# EasyEDA schematic SCH_TSOP-32 Adapter_2022-05-23.json
TITLE: Sheet_1; REV: 1.0; Date: 2022-02-27; Sheet: 1/1; Drawn By: hans61; Company: Your Company
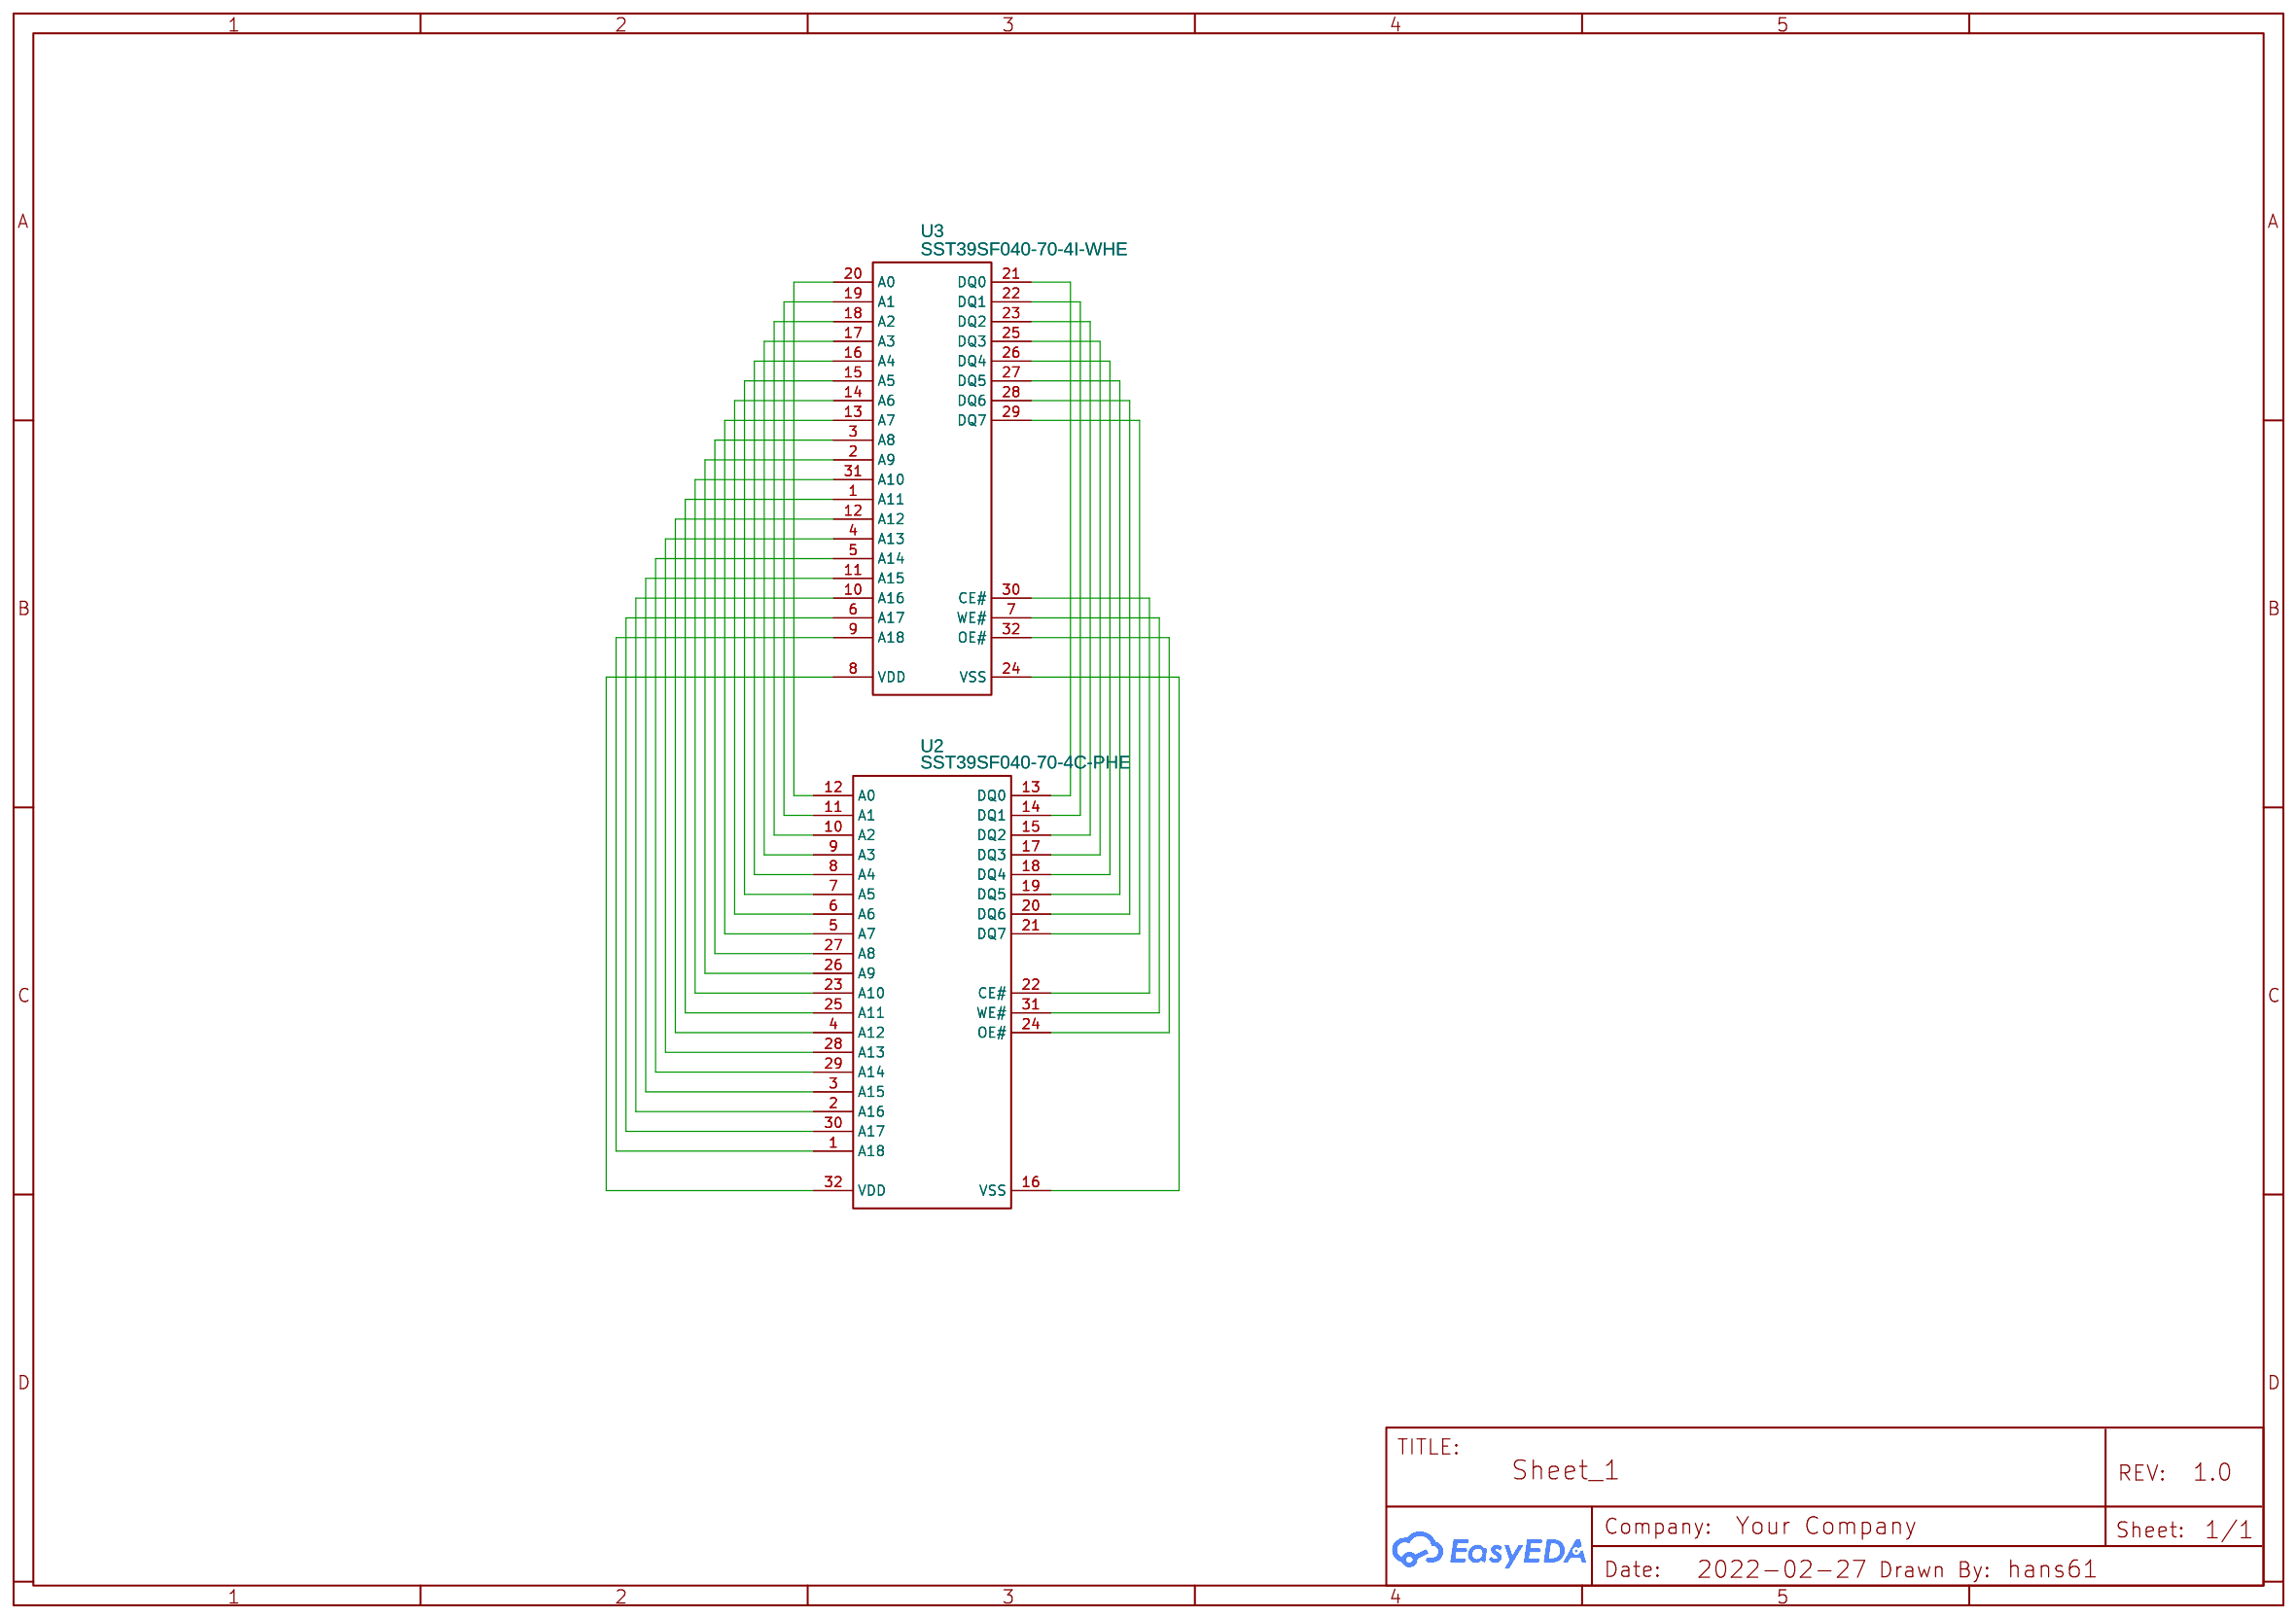
[diagram p0: schematic sheet]

## Parts
U2  SST39SF040-70-4C-PHE  [DIP32-600]
U3  SST39SF040-70-4I-WHE  [MCHP-TSOP-WH32]

## Library data of the parts
U2 = SST39SF040-70-4C-PHE: 4 Mbit Multi-Purpose Flash, 4.5 to 5.5 V, 1 kHz, 0 to 70 degC, 32-pin PDIP (PH32), Tube
U3 = SST39SF040-70-4I-WHE: 4 Mbit Multi-Purpose Flash, 4.5 to 5.5 V, 1 kHz, -40 to 85 degC, 32-pin TSOP (WH32), Tray

## Nets
Net-(U2-1): U2.1(A18) U3.9(A18)
Net-(U2-2): U2.2(A16) U3.10(A16)
Net-(U2-3): U2.3(A15) U3.11(A15)
Net-(U2-4): U2.4(A12) U3.12(A12)
Net-(U2-5): U2.5(A7) U3.13(A7)
Net-(U2-6): U2.6(A6) U3.14(A6)
Net-(U2-7): U2.7(A5) U3.15(A5)
Net-(U2-8): U2.8(A4) U3.16(A4)
Net-(U2-9): U2.9(A3) U3.17(A3)
Net-(U2-10): U2.10(A2) U3.18(A2)
Net-(U2-11): U2.11(A1) U3.19(A1)
Net-(U2-12): U2.12(A0) U3.20(A0)
Net-(U2-13): U2.13(DQ0) U3.21(DQ0)
Net-(U2-14): U2.14(DQ1) U3.22(DQ1)
Net-(U2-15): U2.15(DQ2) U3.23(DQ2)
Net-(U2-16): U2.16(VSS) U3.24(VSS)
Net-(U2-17): U2.17(DQ3) U3.25(DQ3)
Net-(U2-18): U2.18(DQ4) U3.26(DQ4)
Net-(U2-19): U2.19(DQ5) U3.27(DQ5)
Net-(U2-20): U2.20(DQ6) U3.28(DQ6)
Net-(U2-21): U2.21(DQ7) U3.29(DQ7)
Net-(U2-22): U2.22(CE#) U3.30(CE#)
Net-(U2-23): U2.23(A10) U3.31(A10)
Net-(U2-24): U2.24(OE#) U3.32(OE#)
Net-(U2-25): U2.25(A11) U3.1(A11)
Net-(U2-26): U2.26(A9) U3.2(A9)
Net-(U2-27): U2.27(A8) U3.3(A8)
Net-(U2-28): U2.28(A13) U3.4(A13)
Net-(U2-29): U2.29(A14) U3.5(A14)
Net-(U2-30): U2.30(A17) U3.6(A17)
Net-(U2-31): U2.31(WE#) U3.7(WE#)
Net-(U2-32): U2.32(VDD) U3.8(VDD)
